# Altium schematic sheet CODEC 2 &  OUTPUT BUFFER.SchDoc: BULLSEYE
size A3; CompanyName: TYMPHANY; DrawnBy: Yetta.He; Organization: PABU; Address1: 11F,block A, CEC building,; Address2: No.2070 Shennan Zhong road,; Address3: Huaqiang North, Futian District,; Address4: Shenzhen,  Guang Dong, P.R.C 518000; DocumentNumber: 4; Revision: 0.0.5; SheetNumber: 4; SheetTotal: 7; Size: A3; Status: DP1
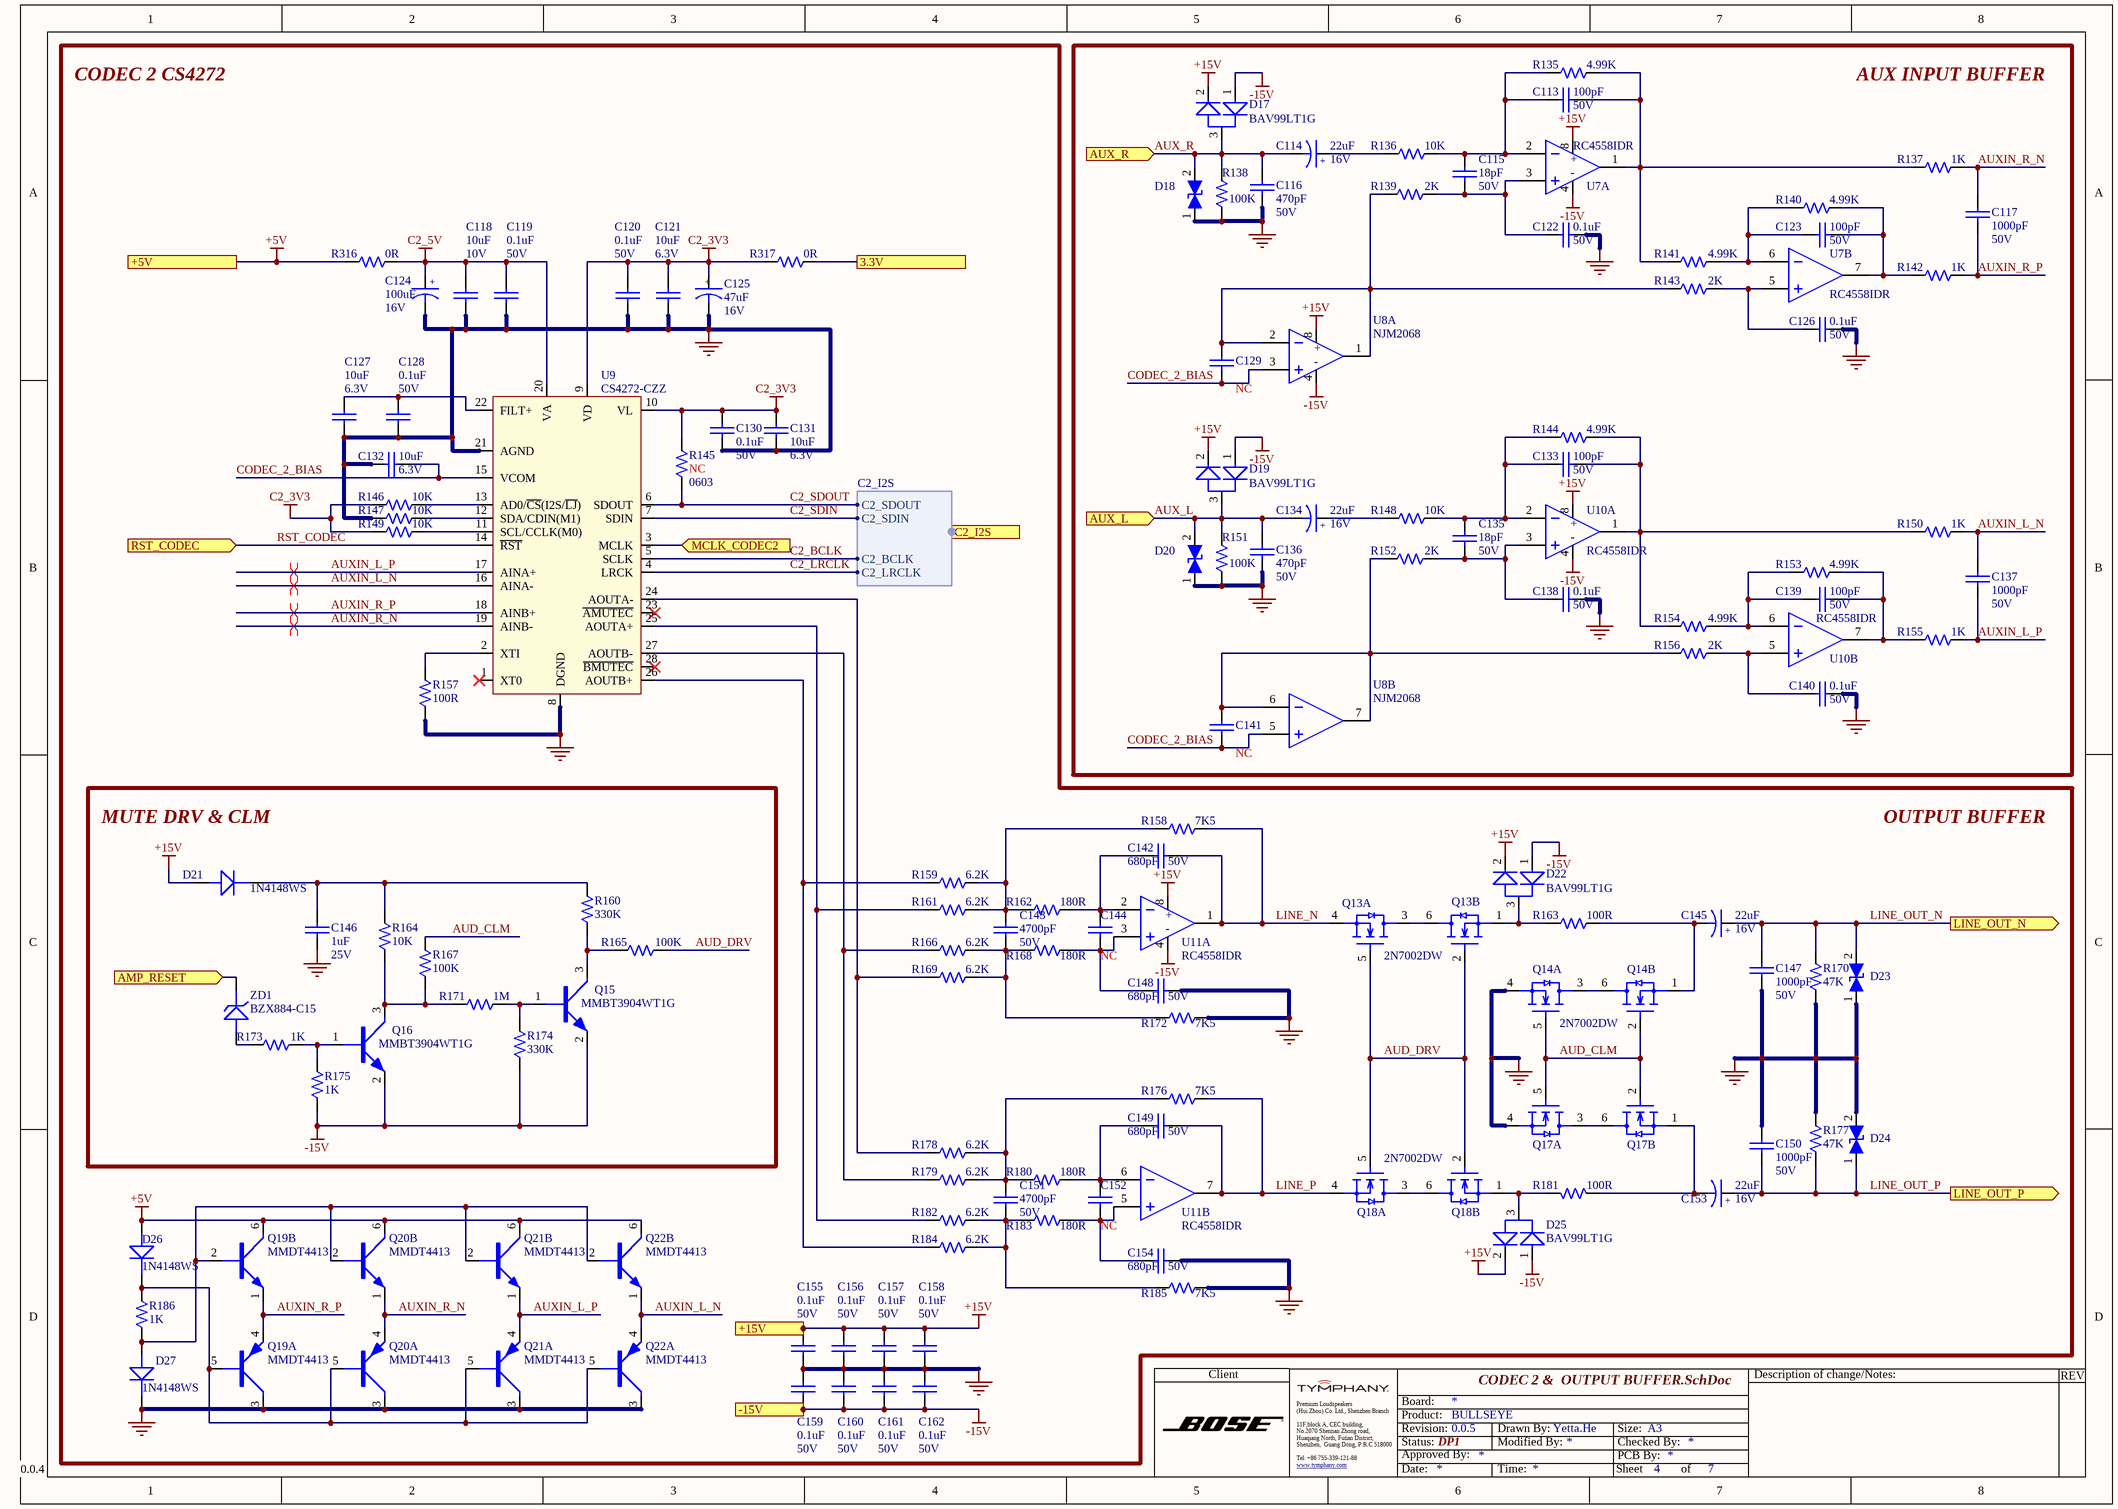
[diagram p0: CODEC 2 &  OUTPUT BUFFER.SchDoc]

## Parts
C113  value 100pF  Voltage: 50V  [CAPC0603-RW]  (hidden comment: T541021015508)
C114  value 22uF  Voltage: 16V  [CASE - B]  (hidden comment: T551220435010)
C115  value 18pF  Voltage: 50V  [CAPC0603-RW]  (hidden comment: PXL410370-1800)
C116  value 470pF  Voltage: 50V  [CAPC0603-RW]  (hidden comment: T541024715508)
C117  value 1000pF  Voltage: 50V  [CAPC0603-RW]  (hidden comment: T541021025508)
C118  value 10uF  Voltage: 10V  [CAPC0603-RW]  (hidden comment: T54000000260E)
C119  value 0.1uF  Voltage: 50V  [CAPC0402-RW]  (hidden comment: PWL456470-1040)
C120  value 0.1uF  Voltage: 50V  [CAPC0402-RW]  (hidden comment: PWL456470-1040)
C121  value 10uF  Voltage: 6.3V  [CAPC0603-RW]  (hidden comment: T54502106710E)
C122  value 0.1uF  Voltage: 50V  [CAPC0603-RW]  (hidden comment: PXL456470-1040)
C123  value 100pF  Voltage: 50V  [CAPC0603-RW]  (hidden comment: T541021015508)
C124  value 100uF  Voltage: 16V  [CASE - D]  (hidden comment: T551101435040)
C125  value 47uF  Voltage: 16V  [CASE - C5.7]  (hidden comment: T551470435020)
C126  value 0.1uF  Voltage: 50V  [CAPC0603-RW]  (hidden comment: PXL456470-1040)
C127  value 10uF  Voltage: 6.3V  [CAPC0603-RW]  (hidden comment: T54502106710E)
C128  value 0.1uF  Voltage: 50V  [CAPC0402-RW]  (hidden comment: PWL456470-1040)
C129  value NC  [CAPC0603-RW]  (hidden comment: CAP0603 NC)
C130  value 0.1uF  Voltage: 50V  [CAPC0402-RW]  (hidden comment: PWL456470-1040)
C131  value 10uF  Voltage: 6.3V  [CAPC0603-RW]  (hidden comment: T54502106710E)
C132  value 10uF  Voltage: 6.3V  [CAPC0603-RW]  (hidden comment: T54502106710E)
C133  value 100pF  Voltage: 50V  [CAPC0603-RW]  (hidden comment: T541021015508)
C134  value 22uF  Voltage: 16V  [CASE - B]  (hidden comment: T551220435010)
C135  value 18pF  Voltage: 50V  [CAPC0603-RW]  (hidden comment: PXL410370-1800)
C136  value 470pF  Voltage: 50V  [CAPC0603-RW]  (hidden comment: T541024715508)
C137  value 1000pF  Voltage: 50V  [CAPC0603-RW]  (hidden comment: T541021025508)
C138  value 0.1uF  Voltage: 50V  [CAPC0603-RW]  (hidden comment: PXL456470-1040)
C139  value 100pF  Voltage: 50V  [CAPC0603-RW]  (hidden comment: T541021015508)
C140  value 0.1uF  Voltage: 50V  [CAPC0603-RW]  (hidden comment: PXL456470-1040)
C141  value NC  [CAPC0603-RW]  (hidden comment: CAP0603 NC)
C142  value 680pF  Voltage: 50V  [CAPC0603-RW]  (hidden comment: PXL410372-6810)
C143  value 4700pF  Voltage: 50V  [CAPC0603-RW]  (hidden comment: T542024727508)
C144  value NC  [CAPC0603-RW]  (hidden comment: CAP0603 NC)
C145  value 22uF  Voltage: 16V  [CASE - B]  (hidden comment: T551220435010)
C146  value 1uF  Voltage: 25V  [CAPC0603-RW]  (hidden comment: PXL456450-1050)
C147  value 1000pF  Voltage: 50V  [CAPC0603-RW]  (hidden comment: T541021025508)
C148  value 680pF  Voltage: 50V  [CAPC0603-RW]  (hidden comment: PXL410372-6810)
C149  value 680pF  Voltage: 50V  [CAPC0603-RW]  (hidden comment: PXL410372-6810)
C150  value 1000pF  Voltage: 50V  [CAPC0603-RW]  (hidden comment: T541021025508)
C151  value 4700pF  Voltage: 50V  [CAPC0603-RW]  (hidden comment: T542024727508)
C152  value NC  [CAPC0603-RW]  (hidden comment: CAP0603 NC)
C153  value 22uF  Voltage: 16V  [CASE - B]  (hidden comment: T551220435010)
C154  value 680pF  Voltage: 50V  [CAPC0603-RW]  (hidden comment: PXL410372-6810)
C155  value 0.1uF  Voltage: 50V  [CAPC0402-RW]  (hidden comment: PWL456470-1040)
C156  value 0.1uF  Voltage: 50V  [CAPC0402-RW]  (hidden comment: PWL456470-1040)
C157  value 0.1uF  Voltage: 50V  [CAPC0402-RW]  (hidden comment: PWL456470-1040)
C158  value 0.1uF  Voltage: 50V  [CAPC0402-RW]  (hidden comment: PWL456470-1040)
C159  value 0.1uF  Voltage: 50V  [CAPC0402-RW]  (hidden comment: PWL456470-1040)
C160  value 0.1uF  Voltage: 50V  [CAPC0402-RW]  (hidden comment: PWL456470-1040)
C161  value 0.1uF  Voltage: 50V  [CAPC0402-RW]  (hidden comment: PWL456470-1040)
C162  value 0.1uF  Voltage: 50V  [CAPC0402-RW]  (hidden comment: PWL456470-1040)
D17  RCD100099-0010  [SOT23-132-RW]  (value not drawn)
D18  T710500020400  [VAR-0402]  (value not drawn)
D19  RCD100099-0010  [SOT23-132-RW]  (value not drawn)
D20  T710500020400  [VAR-0402]  (value not drawn)
D21  RCD114148-0020  [SOD-323]  (value not drawn)
D22  RCD100099-0010  [SOT23-132-RW]  (value not drawn)
D23  T710500020400  [VAR-0402]  (value not drawn)
D24  T710500020400  [VAR-0402]  (value not drawn)
D25  RCD100099-0010  [SOT23-132-RW]  (value not drawn)
D26  RCD114148-0020  [SOD-323]  (value not drawn)
D27  RCD114148-0020  [SOD-323]  (value not drawn)
Q13  RCM027002-1001  [SOT-363]  (value not drawn)  (parts A,B of 2)
Q14  RCM027002-1001  [SOT-363]  (value not drawn)  (parts A,B of 2)
Q15  T581004222440  [SOT323(SC-70)-R]  (value not drawn)
Q16  T581004222440  [SOT323(SC-70)-R]  (value not drawn)
Q17  RCM027002-1001  [SOT-363]  (value not drawn)  (parts A,B of 2)
Q18  RCM027002-1001  [SOT-363]  (value not drawn)  (parts A,B of 2)
Q19  RCC004413-0010  [SOT-363]  (value not drawn)  (parts A,B of 2)
Q20  RCC004413-0010  [SOT-363]  (value not drawn)  (parts A,B of 2)
Q21  RCC004413-0010  [SOT-363]  (value not drawn)  (parts A,B of 2)
Q22  RCC004413-0010  [SOT-363]  (value not drawn)  (parts A,B of 2)
R135  value 4.99K  [0603-RW]  (hidden comment: QCF011030-4991)
R136  value 10K  [0603-RW]  (hidden comment: QCF011030-1002)
R137  value 1K  [0603-RW]  (hidden comment: QCF011030-1001)
R138  value 100K  [0603-RW]  (hidden comment: QCF011030-1003)
R139  value 2K  [0603-RW]  (hidden comment: QCF011030-2001)
R140  value 4.99K  [0603-RW]  (hidden comment: QCF011030-4991)
R141  value 4.99K  [0603-RW]  (hidden comment: QCF011030-4991)
R142  value 1K  [0603-RW]  (hidden comment: QCF011030-1001)
R143  value 2K  [0603-RW]  (hidden comment: QCF011030-2001)
R144  value 4.99K  [0603-RW]  (hidden comment: QCF011030-4991)
R145  value NC  Package: 0603  [0603-RW]  (hidden comment: RES0603 NC)
R146  value 10K  [0402-RW]  (hidden comment: QCF161240-1002)
R147  value 10K  [0402-RW]  (hidden comment: QCF161240-1002)
R148  value 10K  [0603-RW]  (hidden comment: QCF011030-1002)
R149  value 10K  [0402-RW]  (hidden comment: QCF161240-1002)
R150  value 1K  [0603-RW]  (hidden comment: QCF011030-1001)
R151  value 100K  [0603-RW]  (hidden comment: QCF011030-1003)
R152  value 2K  [0603-RW]  (hidden comment: QCF011030-2001)
R153  value 4.99K  [0603-RW]  (hidden comment: QCF011030-4991)
R154  value 4.99K  [0603-RW]  (hidden comment: QCF011030-4991)
R155  value 1K  [0603-RW]  (hidden comment: QCF011030-1001)
R156  value 2K  [0603-RW]  (hidden comment: QCF011030-2001)
R157  value 100R  [0402-RW]  (hidden comment: QCF161240-1000)
R158  value 7K5  [0603-RW]  (hidden comment: QCF011030-7501)
R159  value 6.2K  [0603-RW]  (hidden comment: QCF011030-6201)
R160  value 330K  [0402-RW]  (hidden comment: T502330301399)
R161  value 6.2K  [0603-RW]  (hidden comment: QCF011030-6201)
R162  value 180R  [0603-RW]  (hidden comment: QCF011030-1800)
R163  value 100R  [0603-RW]  (hidden comment: QCF011030-1000)
R164  value 10K  [0402-RW]  (hidden comment: QCF161240-1002)
R165  value 100K  [0603-RW]  (hidden comment: QCF011030-1003)
R166  value 6.2K  [0603-RW]  (hidden comment: QCF011030-6201)
R167  value 100K  [0603-RW]  (hidden comment: QCF011030-1003)
R168  value 180R  [0603-RW]  (hidden comment: QCF011030-1800)
R169  value 6.2K  [0603-RW]  (hidden comment: QCF011030-6201)
R170  value 47K  [0603-RW]  (hidden comment: QCF011030-4702)
R171  value 1M  [0603-RW]  (hidden comment: QCF011030-1004)
R172  value 7K5  [0603-RW]  (hidden comment: QCF011030-7501)
R173  value 1K  [0402-RW]  (hidden comment: QCF161240-1001)
R174  value 330K  [0402-RW]  (hidden comment: T502330301399)
R175  value 1K  [0402-RW]  (hidden comment: QCF161240-1001)
R176  value 7K5  [0603-RW]  (hidden comment: QCF011030-7501)
R177  value 47K  [0603-RW]  (hidden comment: QCF011030-4702)
R178  value 6.2K  [0603-RW]  (hidden comment: QCF011030-6201)
R179  value 6.2K  [0603-RW]  (hidden comment: QCF011030-6201)
R180  value 180R  [0603-RW]  (hidden comment: QCF011030-1800)
R181  value 100R  [0603-RW]  (hidden comment: QCF011030-1000)
R182  value 6.2K  [0603-RW]  (hidden comment: QCF011030-6201)
R183  value 180R  [0603-RW]  (hidden comment: QCF011030-1800)
R184  value 6.2K  [0603-RW]  (hidden comment: QCF011030-6201)
R185  value 7K5  [0603-RW]  (hidden comment: QCF011030-7501)
R186  value 1K  [0603-RW]  (hidden comment: QCF011030-1001)
R316  value 0R  [0603-RW]  (hidden comment: T502000002009)
R317  value 0R  [0603-RW]  (hidden comment: T502000002009)
U7  T610500019101  [D(R-PDSO-G8)]  (value not drawn)  (parts A,B of 2)
U8  RCI002068-0001  [DMP8]  (value not drawn)  (parts A,B of 2)
U9  RCI004272-0001  [TSSOP28]  (value not drawn)
U10  T610500019101  [D(R-PDSO-G8)]  (value not drawn)  (parts A,B of 2)
U11  T610500019101  [D(R-PDSO-G8)]  (value not drawn)  (parts A,B of 2)
ZD1  RCZ025015-0010  [SOD882]  (value not drawn)

## Blocks framed on the sheet
AUX INPUT BUFFER: C113-C117 C122 C123 C126 C129 C133-C141 D17-D20 R135-R144 R148 R150-R156 U7 U8 U10
MUTE DRV & CLM: C146 D21 Q15 Q16 R160 R164 R165 R167 R171 R173-R175 ZD1

## Ports
3.3V, +5V, +15V, -15V, AMP_RESET (in), AUX_L (in), AUX_R (in), C2_I2S (in, harness C2_I2S), LINE_OUT_N (out), LINE_OUT_P (out), MCLK_CODEC2 (in), RST_CODEC (in)

## Harnesses
C2_I2S: C2_SDOUT, C2_SDIN, C2_BCLK, C2_LRCLK

## Nets
+5V: D26.1(A) Q19.6(D) Q20.6(D) Q21.6(D) Q22.6(D) R316.1 ; port +5V
+15V: C155.1 C156.1 C157.1 C158.1 D17.2(K) D19.2(K) D21.1(A) D22.2(K) D25.2(K) U7.8(VCC+) U8.8 U10.8(VCC+) U11.8(VCC+) ; port +15V
-15V: C159.2 C160.2 C161.2 C162.2 D17.1(A) D19.1(A) D22.1(A) D25.1(A) Q15.2(E) Q16.2(E) R174.1 R175.1 U7.4(VCC-) U8.4 U10.4(VCC-) U11.4(VCC-) ; port -15V
C2_3V3: C120.1 C121.1 C125.1 C130.2 C131.2 R145.2 R146.1 R149.1 R317.1 U9.9(VD) U9.10(VL)
C2_5V: C118.1 C119.1 C124.1 R316.2 U9.20(VA)
GND: C116.2 C118.2 C119.2 C120.2 C121.2 C122.2 C124.2 C125.2 C126.2 C127.1 C128.2 C130.1 C131.1 C132.2 C136.2 C138.2 C140.2 C146.2 C147.1 C148.2 C150.2 C154.2 C155.2 C156.2 C157.2 C158.2 C159.1 C160.1 C161.1 C162.1 D18.1 D20.1 D23.1 D24.2 D27.2(K) Q14.4(S) Q17.4(S) Q19.3(D) Q20.3(D) Q21.3(D) Q22.3(D) R138.1 R147.1 R151.1 R157.1 R170.1 R172.2 R177.2 R185.2 U9.8(DGND) U9.21(AGND)
3.3V: R317.2 ; port 3.3V
AMP_RESET: ZD1.2(K) ; port AMP_RESET
AUD_CLM: Q14.2(G) Q14.5(G) Q17.2(G) Q17.5(G) R167.2
AUD_DRV: Q13.2(G) Q13.5(G) Q18.2(G) Q18.5(G) R165.1
AUX_L: C134.2 C136.1 D19.3 D20.2 R151.2 ; port AUX_L
AUX_R: C114.2 C116.1 D17.3 D18.2 R138.2 ; port AUX_R
AUXIN_L_N: C137.1 Q22.1(S) Q22.4(S) R150.2 U9.16(AINA-)
AUXIN_L_P: C137.2 Q21.1(S) Q21.4(S) R155.2 U9.17(AINA+)
AUXIN_R_N: C117.1 Q20.1(S) Q20.4(S) R137.2 U9.19(AINB-)
AUXIN_R_P: C117.2 Q19.1(S) Q19.4(S) R142.2 U9.18(AINB+)
C2_BCLK: U9.5(SCLK) ; port C2_I2S.C2_BCLK
C2_LRCLK: U9.4(LRCK) ; port C2_I2S.C2_LRCLK
C2_SDIN: U9.7(SDIN) ; port C2_I2S.C2_SDIN
C2_SDOUT: R145.1 U9.6(SDOUT) ; port C2_I2S.C2_SDOUT
CODEC_2_BIAS: C129.2 C132.1 C141.2 U8.3(IN+) U8.5(IN+) U9.15(VCOM)
LINE_N: C142.2 Q13.4(S) R158.2 U11.1(1OUT)
LINE_OUT_N: C145.1 C147.2 D23.2 R170.2 ; port LINE_OUT_N
LINE_OUT_P: C150.1 C153.1 D24.1 R177.1 ; port LINE_OUT_P
LINE_P: C149.2 Q18.4(S) R176.2 U11.7(2OUT)
MCLK_CODEC2: U9.3(MCLK) ; port MCLK_CODEC2
RST_CODEC: U9.14(~{RST}) ; port RST_CODEC
NetC113_1: C113.1 C115.1 R135.1 R136.2 U7.2(1IN-)
NetC113_2: C113.2 R135.2 R137.1 R141.2 U7.1(1OUT)
NetC114_1: C114.1 R136.1
NetC115_2: C115.2 C122.1 R139.1 U7.3(1IN+)
NetC123_1: C123.1 R140.1 R141.1 U7.6(2IN-)
NetC123_2: C123.2 R140.2 R142.1 U7.7(2OUT)
NetC126_1: C126.1 R143.1 U7.5(2IN+)
NetC127_2: C127.2 C128.1 U9.22(FILT+)
NetC129_1: C129.1 R139.2 R143.2 U8.1(OUT) U8.2(IN-)
NetC133_1: C133.1 C135.1 R144.1 R148.2 U10.2(1IN-)
NetC133_2: C133.2 R144.2 R150.1 R154.2 U10.1(1OUT)
NetC134_1: C134.1 R148.1
NetC135_2: C135.2 C138.1 R152.1 U10.3(1IN+)
NetC139_1: C139.1 R153.1 R154.1 U10.6(2IN-)
NetC139_2: C139.2 R153.2 R155.1 U10.7(2OUT)
NetC140_1: C140.1 R156.1 U10.5(2IN+)
NetC141_1: C141.1 R152.2 R156.2 U8.6(IN-) U8.7(OUT)
NetC142_1: C142.1 C144.1 R162.2 U11.2(1IN-)
NetC143_1: C143.1 R158.1 R159.2 R161.2 R162.1
NetC143_2: C143.2 R166.2 R168.1 R169.2 R172.1
NetC144_2: C144.2 C148.1 R168.2 U11.3(1IN+)
NetC145_2: C145.2 Q14.1(S) R163.2
NetC146_1: C146.1 D21.2(K) R160.2 R164.2
NetC149_1: C149.1 C152.1 R180.2 U11.6(2IN-)
NetC151_1: C151.1 R176.1 R178.2 R179.2 R180.1
NetC151_2: C151.2 R182.2 R183.1 R184.2 R185.1
NetC152_2: C152.2 C154.1 R183.2 U11.5(2IN+)
NetC153_2: C153.2 Q17.1(S) R181.2
NetD22_3: D22.3 Q13.1(S) R163.1
NetD25_3: D25.3 Q18.1(S) R181.1
NetD26_2: D26.2(K) Q19.5(G) Q20.5(G) Q21.5(G) Q22.5(G) R186.2
NetD27_1: D27.1(A) Q19.2(G) Q20.2(G) Q21.2(G) Q22.2(G) R186.1
NetQ13_3: Q13.3(D) Q13.6(D)
NetQ14_3: Q14.3(D) Q14.6(D)
NetQ15_1: Q15.1(B) R171.2 R174.2
NetQ15_3: Q15.3(C) R160.1 R165.2
NetQ16_1: Q16.1(B) R173.1 R175.2
NetQ16_3: Q16.3(C) R164.1 R167.1 R171.1
NetQ17_3: Q17.3(D) Q17.6(D)
NetQ18_3: Q18.3(D) Q18.6(D)
NetR146_2: R146.2 U9.13(AD0/~{CS}(I2S/~{LJ}))
NetR147_2: R147.2 U9.12(SDA/CDIN(M1))
NetR149_2: R149.2 U9.11(SCL/CCLK(M0))
NetR157_2: R157.2 U9.2(XTI)
NetR159_1: R159.1 R184.1 U9.26(AOUTB+)
NetR161_1: R161.1 R182.1 U9.25(AOUTA+)
NetR166_1: R166.1 R179.1 U9.27(AOUTB-)
NetR169_1: R169.1 R178.1 U9.24(AOUTA-)
NetR173_2: R173.2 ZD1.1(A)

Not connected (* = marked no-connect by the designer): U9 1(XT0)* 23(~{AMUTEC})* 28(~{BMUTEC})*

## Layout directives
differential pair: AUXIN_L_N, AUXIN_L_P, AUXIN_R_N, AUXIN_R_P

## Notes on the sheet
- CODEC 2 CS4272
- OUTPUT BUFFER
- 0.0.4
- Client
- Description of change/Notes:
- REV
- Premium Loudspeakers
- (Hui Zhou) Co. Ltd., Shenzhen Branch
- Tel: +86 755-339-121-88
- Board:
- Status:
- Revision:
- Product:
- Approved By:
- Drawn By:
- Modified By:
- Checked By:
- PCB By:
- Size:
- www.tymphany.com <http://www.tymphany.com>
- Date:
- Time:
- Sheet
- of
- (in symbol CAP E 22uF 16V 20% SMD_VEJ220M1CTR-0405) +
- (in symbol CAP E 47uF 16V 20% SMD_VEJ470M1CTR-0506) +
- (in symbol CAP E 100uF 16V 20% SMD-VZH101M1CTR-0605) +
- (in symbol NJM2068, part A) +; -
- (in symbol RC4558IDR, part A) +; -

## Library data of the parts
C113 C123 C133 C139 = CAP0603 100pF 50V 2%_NPO_WALSIN: CAP NPO 100PF 50V +-2% 0603 WALSIN L; Tolerance: 2%; Type: Capacitor; CREATE_NAME: Nathan; DIP&SMD: SMD; SAP: T541021015508; PACKAGE: CAPC0603; Vendor Name: *; MFG: WALSIN; MFG Part: *; Other: NPO; CREATE_TIME: 13-July-2016; Customer Specific: N/A
C114 C134 = CAP E 22uF 16V 20% SMD_VEJ220M1CTR-0405: E 22UF 16V +-20% 4.3X4. VEJ220M1C K; MFG: LELON; Type: Capacitor; CREATE_NAME: Nathan; DIP&SMD: SMD; SAP: T551220435010; PACKAGE: CASE - B; MFG Part: VEJ220M1CTR-0405; Other: *; CREATE_TIME: 01-Mar-2019; Customer Specific: N/A
C115 C135 = CAP0603 18pF 50V 5% - PXL410370-1800: CHIP CAP 18pF 50V 5% 0603 TYPE NPO; SAP: T541021806508; Vendor Code: 10010262; Vendor Name: 东莞市晴远电子有限公司; Type: Capacitor; PACKAGE: CAPC0603; MFG: *; MFG Part: *; Other: NPO; Tolerance: 5%
C116 C136 = CAP0603 470pF 50V 2%_NPO_WALSIN: CAP NPO 470PF 50V +-2% 0603 WALSIN L; Tolerance: 2%; Type: Capacitor; CREATE_NAME: Nathan; DIP&SMD: SMD; SAP: T541024715508; PACKAGE: CAPC0603; Vendor Name: *; MFG: WALSIN; MFG Part: *; Other: NPO; CREATE_TIME: 13-July-2016; Customer Specific: N/A
C117 C137 = CAP0603 1000pF 50V 2%_NPO_WALSIN: CAP NPO 1000P 50V +-2% 0603 WALSIN L; Tolerance: 2%; Type: Capacitor; CREATE_NAME: Nathan; DIP&SMD: SMD; SAP: T541021025508; PACKAGE: CAPC0603; Vendor Name: *; MFG: WALSIN; MFG Part: *; Other: NPO; CREATE_TIME: 13-July-2016; Customer Specific: N/A
C118 = CAP0603 10uF 10V 20%_X5R_SAMSUNG: CAP 10UF 10V +-20% 0603X5R SAMSUNG L; Other: X5R; Tolerance: 20%,; Type: Capacitor; CREATE_NAME: Nathan; DIP&SMD: SMD; SAP: T54000000260E; PACKAGE: CAPC0603; Vendor Code: *; Vendor Name: *; MFG: SAMSUNG; MFG Part: *; CREATE_TIME: 16-Feb-2019; Customer Specific: N/A
C119 C120 C128 C130 = CAP0402 0.1uF 50V 10%: CAP X7R .10UF 50V +-10% 0402 WALSIN L; SAP: T542011047508; Tolerance: 10%; Type: Capacitor; CREATE_NAME: TOM@Deftronics; DIP&SMD: SMD; PACKAGE: CAPC0402; Vendor Name: *; MFG: *; MFG Part: *; Other: X7R; CREATE_TIME: 13-May-2014; Customer Specific: N/A
C121 C127 C131 C132 = CAP0603 10uF 6.3V 10%_X5R_SAMSUNG: CAP X5R 10UF 6.3V +-10% 0603 SAMSUN L; MFG Part: CL10A106KQ8NNNC; Tolerance: 10%; Type: Capacitor; CREATE_NAME: Nathan; DIP&SMD: SMD; SAP: T54502106710E; PACKAGE: CAPC0603; Vendor Code: *; Vendor Name: *; MFG: SAMSUNG; Other: X5R; CREATE_TIME: 30-Oct-2018; Customer Specific: N/A
C122 C126 C138 C140 = CAP0603 0.1uF 50V 10% - PXL456470-1040: GP CHIP CAP 0.1uF 50V 10% 0603 TYPE X7R; SAP: T542021047508; Vendor Code: 10010262; Vendor Name: 东莞市晴远电子有限公司; Type: Capacitor; PACKAGE: CAPC0603; MFG: *; MFG Part: *; Other: X7R; Tolerance: 10%
C124 = CAP E 100uF 16V 20% SMD-VZH101M1CTR-0605: E 100UF 16V +-20% 6.3*5. VZH101M1C L; MFG: LELON; Type: Capacitor; CREATE_NAME: Nathan; DIP&SMD: SMD; Tolerance: 20%; SAP: T551101435040; PACKAGE: CASE - D; MFG Part: VZH101M1CTR-0605; Other: *; CREATE_TIME: 03-May-2019; Customer Specific: N/A; Vendor Name: *; Vendor Code: *
C125 = CAP E 47uF 16V 20% SMD_VEJ470M1CTR-0506: E 47UF 16V +-20% 5X6 VEJ470M1C K; MFG: LELON; Tolerance: 20%; Type: Capacitor; DIP&SMD: SMD; CREATE_NAME: Nathan; SAP: T551470435020; PACKAGE: CASE - C5.7; Vendor Name: *; Vendor Code: *; MFG Part: VEJ470M1CTR-0506; Other: *; Customer Specific: N/A; CREATE_TIME: 15-Mar-2019
C129 C141 C144 C152 = CAP0603 NC: NC; Type: Capacitor; CREATE_NAME: Tom; DIP&SMD: SMD; SAP: *; PACKAGE: CAPC0603; Vendor Code: *; Vendor Name: *; MFG: *; MFG Part: *; Other: *; Tolerance: *; CREATE_TIME: 18-Mar-2016; Voltage: *; Customer Specific: N/A
C142 C148 C149 C154 = CAP0603 680pF 50V 5% - PXL410372-6810: GP CHIP CAP 680pF 50V 5% 0603 NPO; SAP: T541026816508; Vendor Code: 10010262; Vendor Name: 东莞市晴远电子有限公司; Type: Capacitor; DIP&SMD: SMD; PACKAGE: CAPC0603; MFG: *; MFG Part: *; Other: NPO; Tolerance: 5%; Customer Specific: N/A
C143 C151 = CAP0603 4700pF 50V 10%_X7R_WALSIN: CAP X7R 4700P 50V +-10% 0603 WALSIN L; Tolerance: 10%; Type: Capacitor; CREATE_NAME: Nathan; DIP&SMD: SMD; SAP: T542024727508; PACKAGE: CAPC0603; Vendor Name: *; MFG: WALSIN; MFG Part: *; Other: X7R; CREATE_TIME: 12-Mar-2019; Customer Specific: N/A
C145 C153 = CAP E 22uF 16V 20% SMD_VEJ220M1CTR-0405: E 22UF 16V +-20% 4.3X4. VEJ220M1C K; MFG: LELON; CREATE_NAME: Nathan; Type: Capacitor; DIP&SMD: SMD; SAP: T551220435010; PACKAGE: CASE - B; MFG Part: VEJ220M1CTR-0405; Other: *; CREATE_TIME: 01-Mar-2019; Customer Specific: N/A
C146 = CAP0603 1uF 25V 10% - PXL456450-1050: CHIP CAP 1uF 25V 10% 0603 TYPE X7R; SAP: T542021057408; Vendor Code: 10010262; Vendor Name: 东莞市晴远电子有限公司; Type: Capacitor; PACKAGE: CAPC0603; MFG: *; MFG Part: *; Other: X7R; Tolerance: 10%
C147 C150 = CAP0603 1000pF 50V 2%_NPO_WALSIN: CAP NPO 1000P 50V +-2% 0603 WALSIN L; Tolerance: 2%; Type: Capacitor; CREATE_NAME: Nathan; SAP: T541021025508; PACKAGE: CAPC0603; Vendor Name: *; MFG: WALSIN; MFG Part: *; Other: NPO; CREATE_TIME: 13-July-2016
C155-C162 = CAP0402 0.1uF 50V 10%: CAP, CER, 0.1uF, 10%, 50V, X7R, 0402, RoHS; SAP: T542011047508; Type: Capacitor; CREATE_NAME: TOM@Deftronics; PACKAGE: CAPC0402; Vendor Name: *; MFG: *; MFG Part: *; Other: X7R; Tolerance: 10%; CREATE_TIME: 13-May-2014
D17 D19 D22 D25 = BAV99LT1G: SWITC 70V 215MA BAV99LT1G ON SE G; SAP: T572003550122; MFG: ON SEMI; Voltage: 100V; Power: 225MW; Type: DIODE; DIP&SMD: SMD; Vendor Code: *; Vendor Name: *; Current: 215mA; Customer Specific: N/A; Package: SOT-23; MFG Part: BAV99LT1G
D18 D20 D23 D24 = AVRM1005C120MTAAB: VR AVRM1005C120MTAAB TDK K; Type: Zener DIODE; CREAT NAME: QCD; DIP&SMD: SMD; SAP: T710500020400; MFG: TDK; Vendor Code: *; Vendor Name: *; CREAT TIME: 02-Sep-2016; MFG Part: AVRM1005C120MTAAB
D21 = 1N4148WS: DIODE SW 1N4148 VF=0.7V SOD-323; MFG: TW SEMICONDUCTOR; SAP: T572005070208; Voltage: 100V; Current: 150MA; DIP&SMD: SMD; Vendor Name: *; Vendor Code: *; Type: DIODE; Package: SOD-323; Customer Specific: N/A; MFG Part: 1N4148WS
D26 D27 = 1N4148WS: DIODE SW 1N4148 VF=0.7V SOD-323; MFG: TW SEMICONDUCTOR; SAP: T572005070208; Voltage: 100V; Current: 150MA; Vendor Name: *; Vendor Code: *; Type: DIODE; Package: SOD-323; MFG Part: 1N4148WS
Q13 Q14 Q17 Q18 = 2N7002DW: SMD MOSFET N-CH SOT-363 2N7002DW      Fairchild; SAP: T586002602738; CREATE_NAME: Evan@Deftronics; MFG: Fairchild; Vendor Name: *; Vendor Code: *; Voltage: *; Current: *; Type: MOSFET; CREATE_TIME: 7-May-2014; DIP&SMD: SMD; Customer Specific: N/A
  Q13 Q18: MFG Part: 2N7002DW
Q15 Q16 = MMBT3904WT1G: NPN 40V MMBT3904WT1G SC70 ( ON K; CREATE_NAME: Nathan; DIP&SMD: SMD; SAP: T581004222440; MFG: ON; Vendor Code: *; Vendor Name: *; Voltage: *; Type: NPN; CREATE_TIME: 11-Mar-2019; Current: *; MFG Part: MMBT3904WT1G; Customer Specific: N/A
Q19-Q22 = MMDT4413: COMPOSOTE TRANSISTOR SOT-363 MMDT4413; MFG: DIODES; SAP: T580000432738; CREATE_NAME: Nathan; Vendor Name: *; Vendor Code: *; Voltage: *; Current: *; Type: TRANSISTOR; CREATE_TIME: 20-OCT-2014; MFG_Part: MMDT4413
R135 R140 R141 R144 R153 R154 = RES0603 1/10W 1% 4.99K OHM: GP CHIP RES. 4.99K OHM 1/10W 1% 0603; Vendor Code: 10010262; SAP: T502499102399; Vendor Name: 东莞市晴远电子有限公司; Power: *; MFG Part: *; MFG: *; TOL: 1%; Type: Resistor; PACKAGE: 0603
R136 R148 = RES0603 1/10W 1% 10K OHM: GP CHIP RES. 10K OHM 1/10W 1% 0603; Vendor Code: 10010262; SAP: T502100202399; Vendor Name: 东莞市晴远电子有限公司; DIP&SMD: SMD; Power: 1/10W; MFG Part: *; MFG: *; TOL: 1%; Type: Resistor; PACKAGE: 0603; Customer Specific: N/A
R137 R142 R150 R155 = RES0603 1/10W 1% 1K OHM: GP CHIP RES. 1K OHM 1/10W 1% 0603; SAP: T502100102399; Vendor Code: 10010262; Vendor Name: 东莞市晴远电子有限公司; DIP&SMD: SMD; PACKAGE: 0603; TOL: 1%; MFG Part: *; MFG: *; Type: Resistor; Power: 1/10W; Customer Specific: N/A
R138 R151 R165 R167 = RES0603 1/10W 1% 100K OHM: GP CHIP RES. 100K OHM 1/10W 1% 0603; Vendor Code: 10010262; SAP: T502100302399; Vendor Name: 东莞市晴远电子有限公司; DIP&SMD: SMD; Power: 1/10W; MFG Part: *; MFG: *; TOL: 1%; Type: Resistor; PACKAGE: 0603; Customer Specific: N/A
R139 R143 R152 R156 = RES0603 1/10W 1% 2K OHM: GP CHIP RES. 2K OHM 1/10W 1% 0603; Vendor Code: 10010262; SAP: T502200102399; Vendor Name: 东莞市晴远电子有限公司; Power: *; MFG Part: *; MFG: *; TOL: 1%; Type: Resistor; PACKAGE: 0603
R145 = RES0603 NC: NC; CREATE_NAME: Tom; DIP&SMD: SMD; Vendor Code: *; SAP: *; Power: *; Vendor Name: *; MFG Part: *; MFG: *; Tolerance: *; Type: Resistor; CREATE_TIME: 18-Mar-2016; Customer Specific: N/A
R146 R147 R149 R164 = RES0402 1/16W 1% 10K OHM: CHIP RES 10K OHM 1/16W 1% 0402; SAP: T502100201399; MFG: WALSIN; DIP&SMD: SMD; Vendor Code: *; Power: 1/16W; Vendor Name: *; MFG Part: *; TOL: 1%; Type: Resistor; PACKAGE: 0402; Customer Specific: N/A
R157 = RES0402 1/16W 1% 100 OHM: CHIP RES 100 OHM 1/16W 1% 0402; SAP: T502100001399; MFG: WALSIN; Vendor Code: *; Power: *; Vendor Name: *; MFG Part: *; TOL: 1%; Type: Resistor; PACKAGE: 0402
R158 R172 R176 R185 = RES0603 1/10W 1% 7.5K OHM: CHIP RES 7.5K OHM 1/10W 1% 0603; Vendor Code: 10010262; SAP: T502750102399; Vendor Name: 东莞市晴远电子有限公司; CREATE_NAME: Nathan; DIP&SMD: SMD; Power: *; MFG Part: *; MFG: *; TOL: 1%; Type: Resistor; Power: 1/10W; CREATE_TIME: 26-NOV-2014; PACKAGE: 0603; Customer Specific: N/A
R159 R161 R166 R169 R178 R179 R182 R184 = RES0603 1/10W 1% 6.2K OHM: GP CHIP RES. 6.2K OHM 1/10W 1% 0603; Vendor Code: 10010262; SAP: T502620102399; Vendor Name: 东莞市晴远电子有限公司; DIP&SMD: SMD; Power: 1/10W; MFG Part: *; MFG: *; TOL: 1%; Type: Resistor; PACKAGE: 0603; Customer Specific: N/A
R160 R174 = RES0402 1/16W 1% 330K OMH_WALSIN: CHIP 330K OHM  100PPM +-1% 0402 WALS; TOL: 1%; MFG: WALSIN (華新); Power: 1/16W; CREATE_NAME: Nathan; DIP&SMD: SMD; SAP: T502330301399; Package: 0402; MFG Part: *; Vendor Code: *; Vendor Name: *; Type: Resistor; CREATE_TIME: 25-May-2016; Customer Specific: N/A
R162 R168 R180 R183 = RES0603 1/10W 1% 180 OHM: CHIP RES. 180 OHM 1/10W 1% 0603; Vendor Code: 10010262; SAP: T502180002399; Vendor Name: 东莞市晴远电子有限公司; DIP&SMD: SMD; Power: 1/10W; MFG Part: *; MFG: *; TOL: 1%; Type: Resistor; PACKAGE: 0603; Customer Specific: N/A
R163 R181 = RES0603 1/10W 1% 100 OHM: CHIP 100 OHM 100PPM +-1% 0603 WALS L; Vendor Code: 10010262; SAP: T502100002399; Power: 1/10W; Vendor Name: 东莞市晴远电子有限公司; MFG: WALSIN (華新); TOL: 1%; DIP&SMD: SMD; MFG Part: *; Type: Resistor; PACKAGE: 0603; Customer Specific: N/A
R170 R177 = RES0603 1/10W 1% 47K OHM: GP CHIP RES. 47K OHM 1/10W 1% 0603; Vendor Code: 10010262; SAP: T502470202399; Vendor Name: 东莞市晴远电子有限公司; Power: *; MFG Part: *; MFG: *; TOL: 1%; Type: Resistor; PACKAGE: 0603
R171 = RES0603 1/10W 1% 1M OHM: GP CHIP RES. 1M OHM 1/10W 1% 0603; Vendor Code: 10010262; SAP: T502100402399; Vendor Name: 东莞市晴远电子有限公司; DIP&SMD: SMD; Power: 1/10W; MFG Part: *; MFG: *; TOL: 1%; Type: Resistor; PACKAGE: 0603; Customer Specific: N/A
R173 R175 = RES0402 1/16W 1% 1K OHM: CHIP RES 1K OHM 1/16W 1% 0402; SAP: T502100101399; MFG: WALSIN; DIP&SMD: SMD; Vendor Code: *; Power: 1/16W; Vendor Name: *; MFG Part: *; TOL: 1%; Type: Resistor; PACKAGE: 0402; Customer Specific: N/A
R186 = RES0603 1/10W 1% 1K OHM: GP CHIP RES. 1K OHM 1/10W 1% 0603; Vendor Code: 10010262; SAP: T502100102399; Vendor Name: 东莞市晴远电子有限公司; DIP&SMD: SMD; Power: 1/10W; MFG Part: *; MFG: *; TOL: 1%; Type: Resistor; PACKAGE: 0603; Customer Specific: N/A
R316 R317 = RES0603 1/10W 0 OHM_WALSIN: CHIP 0 OHM 0 OHM 0 OHM 0603 WALSIN L; MFG Part: WR06X000PTL; Power: 1/10W; MFG: WALSIN (華新); DIP&SMD: SMD; Vendor Code: *; SAP: T502000002009; Vendor Name: *; TOL: *; Type: Resistor; PACKAGE: 0603; Customer Specific: N/A
U7 U10 U11 = RC4558IDR: OP RC4558IDR SOP-8 TI G; CREATE_NAME: Nathan; DIP&SMD: SMD; CREATE_TIME: 16-Aug-2017; MFG: TI; SAP: T610500019101; TYPE: IC; Value: *; Vendor Code: *; Vendor Name: *; Customer Specific: N/A; MFG Part: RC4558IDR
U8 = NJM2068: IC OP AMP NJM2068 DUAL SO-8; MFG: JRC; SAP: T610500024606; CREATE_NAME: GordonL@Deftronics; DIP&SMD: SMD; Vendor Code: *; Vendor Name: *; Type: IC; CREATE_TIME: 31-MAY-2013; Customer Specific: N/A; MFG Part: NJM2068
U9 = CS4272-CZZ: IC CODEC CS4272-CZZ TSSOP-28; SAP: T611500002006; MFG: CIRRUS LOGIC; CREATE_NAME: GordonL@Deftronics; DIP&SMD: SMD; Vendor Name: *; Vendor Code: *; CREATE_TIME: 31-MAY-2013; Type: IC; Customer Specific: N/A; MFG Part: CS4272-CZZ
ZD1 = BZX884-C15: CHIP ZENER 250mW SOD-882 BZX884-C15 15V; MFG: NXP; SAP: T573003501815; CREATE_NAME: XIN@Deftronics; DIP&SMD: SMD; Vendor Name: *; Vendor Code: *; Voltage: 15V; Current: *; CREATE_TIME: 17-Apr-2014; MFG Part: BZX884-C15; Type: DIODE; Package: SOD882; Customer Specific: N/A